# Altium schematic sheet node1.SchDoc
size A
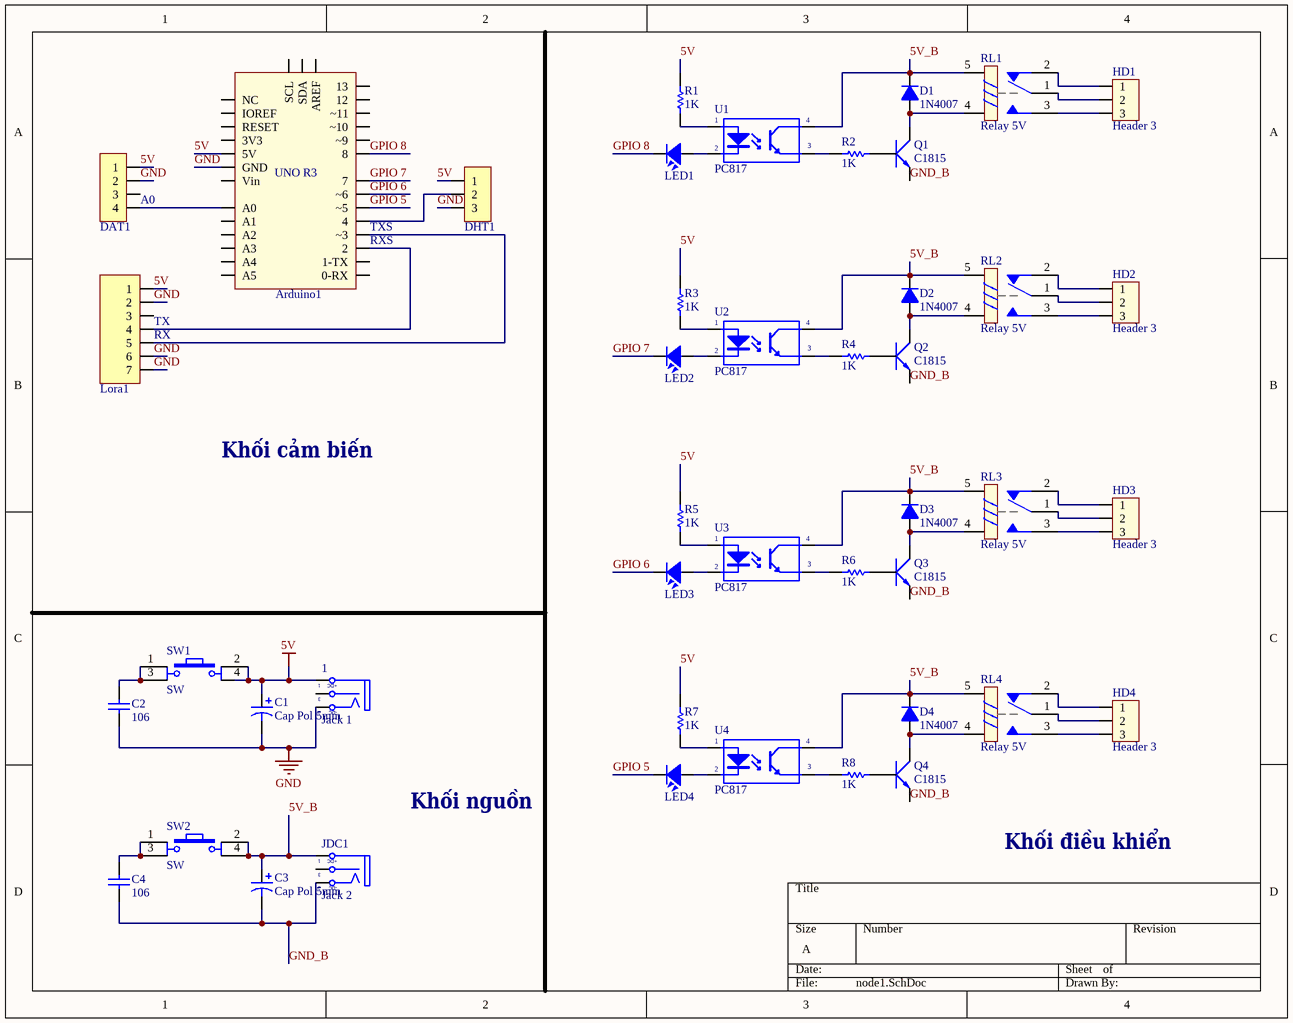
[diagram p0: node1.SchDoc]

## Parts
1  Jack 1  [DC-IN]
Arduino1  Arduino Uno R3  [Arduino UNO R3]  (value not drawn)
C1  Cap Pol 5mm  [C5mm]
C2  106  [Tu 0805]
C3  Cap Pol 5mm  [C5mm]
C4  106  [Tu 0805]
D1  1N4007  [D1A]
D2  1N4007  [D1A]
D3  1N4007  [D1A]
D4  1N4007  [D1A]
DAT1  (no value)  [JP4-C1T]
DHT1  (no value)  [JP3-C1T]
HD1  Header 3  [HED3]
HD2  Header 3  [HED3]
HD3  Header 3  [HED3]
HD4  Header 3  [HED3]
JDC1  Jack 2  [DC-IN]
LED1  LED  [LED-3]  (value not drawn)
LED2  LED  [LED-3]  (value not drawn)
LED3  LED  [LED-3]  (value not drawn)
LED4  LED  [LED-3]  (value not drawn)
Lora1  (no value)  [JP7-C1T]
Q1  C1815  [QTO-92]
Q2  C1815  [QTO-92]
Q3  C1815  [QTO-92]
Q4  C1815  [QTO-92]
R1  value 1K  [R1/4W]  (hidden comment: Res1)
R2  value 1K  [R1/4W]  (hidden comment: Res1)
R3  value 1K  [R1/4W]  (hidden comment: Res1)
R4  value 1K  [R1/4W]  (hidden comment: Res1)
R5  value 1K  [R1/4W]  (hidden comment: Res1)
R6  value 1K  [R1/4W]  (hidden comment: Res1)
R7  value 1K  [R1/4W]  (hidden comment: Res1)
R8  value 1K  [R1/4W]  (hidden comment: Res1)
RL1  Relay 5V  [RL_SPDT_10A]
RL2  Relay 5V  [RL_SPDT_10A]
RL3  Relay 5V  [RL_SPDT_10A]
RL4  Relay 5V  [RL_SPDT_10A]
SW1  SW  [SW4]
SW2  SW  [SW4]
U1  PC817  [DIP4/W0.3]
U2  PC817  [DIP4/W0.3]
U3  PC817  [DIP4/W0.3]
U4  PC817  [DIP4/W0.3]

## Nets
5V: 1.1(T) Arduino1.5V C1.1 DAT1.1 DHT1.1 Lora1.1 R1.2 R3.2 R5.2 R7.2 SW1.2 SW1.4
GND: 1.2(TN) Arduino1.GND C1.2 C2.2 DAT1.2 DHT1.3 Lora1.2 Lora1.6 Lora1.7
5V_B: C3.1 D1.2(K) D2.2(K) D3.2(K) D4.2(K) JDC1.1(T) RL1.5 RL2.5 RL3.5 RL4.5 SW2.2 SW2.4 U1.4(C) U2.4(C) U3.4(C) U4.4(C)
GND_B: C3.2 C4.2 JDC1.2(TN) Q1.1(E) Q2.1(E) Q3.1(E) Q4.1(E)
GPIO 5: Arduino1.~5 LED4.2
GPIO 6: Arduino1.~6 LED3.2
GPIO 7: Arduino1.7 LED2.2
GPIO 8: Arduino1.8 LED1.2
NetArduino1_2: Arduino1.2 Lora1.4
NetArduino1_4: Arduino1.4 DHT1.2
NetArduino1_A0: Arduino1.A0 DAT1.4
NetArduino1_~3: Arduino1.~3 Lora1.5
NetC2_1: C2.1 SW1.1 SW1.3
NetC4_1: C4.1 SW2.1 SW2.3
NetD1_1: D1.1(A) Q1.2(C) RL1.4
NetD2_1: D2.1(A) Q2.2(C) RL2.4
NetD3_1: D3.1(A) Q3.2(C) RL3.4
NetD4_1: D4.1(A) Q4.2(C) RL4.4
NetHD1_1: HD1.1 RL1.2
NetHD1_2: HD1.2 RL1.1
NetHD1_3: HD1.3 RL1.3
NetHD2_1: HD2.1 RL2.2
NetHD2_2: HD2.2 RL2.1
NetHD2_3: HD2.3 RL2.3
NetHD3_1: HD3.1 RL3.2
NetHD3_2: HD3.2 RL3.1
NetHD3_3: HD3.3 RL3.3
NetHD4_1: HD4.1 RL4.2
NetHD4_2: HD4.2 RL4.1
NetHD4_3: HD4.3 RL4.3
NetLED1_1: LED1.1 U1.2(K)
NetLED2_1: LED2.1 U2.2(K)
NetLED3_1: LED3.1 U3.2(K)
NetLED4_1: LED4.1 U4.2(K)
NetQ1_3: Q1.3(B) R2.1
NetQ2_3: Q2.3(B) R4.1
NetQ3_3: Q3.3(B) R6.1
NetQ4_3: Q4.3(B) R8.1
NetR1_1: R1.1 U1.1(A)
NetR2_2: R2.2 U1.3(E)
NetR3_1: R3.1 U2.1(A)
NetR4_2: R4.2 U2.3(E)
NetR5_1: R5.1 U3.1(A)
NetR6_2: R6.2 U3.3(E)
NetR7_1: R7.1 U4.1(A)
NetR8_2: R8.2 U4.3(E)

Not connected (* = marked no-connect by the designer): 1 3(S); Arduino1 0-RX 1-TX 3V3 12 13 A1 A2 A3 A4 A5 AREF IOREF NC RESET SCL SDA Vin ~9 ~10 ~11; DAT1 3; JDC1 3(S); Lora1 3

## Notes on the sheet
- (near DAT1) A0
- (near Arduino1) TXS
- (near Arduino1) RXS
- (near Lora1) TX
- (near Lora1) RX
- Khối cảm biến
- Khối nguồn
- Khối điều khiển
- (in symbol Arduino Uno R3) UNO R3
- (in symbol Jac_DC) +DC; -DC

## Library data of the parts
1 JDC1 = Jac_DC: Cắm; Ten_Linh_Kien: Jack DC5.5x2.1MM DC5501; Ma_Hang: MH000923; Don_Vi: Con; Kieu_Chan: *; Ghi_Chu: *; Chung_Loai: Cắm
Arduino1 = Arduino Uno R3: Value: Cau 1A
C1 C3 = Cap Pol 5mm: Polarized Capacitor (Axial); Published: 8-Jun-2000; LatestRevisionDate: 17-Jul-2002; LatestRevisionNote: Re-released for DXP Platform.; PackageReference: POLAR0.8; Publisher: Altium Limited
C2 C4 = Tu 0805 106 16V 10%: Dán; Ten_Linh_Kien: Tụ 0805 106-10uF 10% 16V; So_Chan: 2; Don_Vi: Con; Ma_Hang: MH004553; Chung_Loai: Dán; Kieu_Chan: *
D1-D4 = D1A: Diode 1A; Value: 1N4007
DAT1 = JP4: WR-PHD 2.54 mm Angled Socket Header; Manufacturer: W¨¹rth Elektronik eiSos GmbH; partNo: 613004143121; ComponentLink1 Description: Manufacturer; ComponentLink2 Description: Datasheet; NoPins: 04; Created Date: 29 March 2013; ComponentLink1URL: http://www.we-online.com; ComponentLink2URL: http://katalog.we-online.de/em/datasheet/6130xx143121.pdf; Created by: Karrer Zheng
DHT1 = JP3: WR-PHD 2.54 mm Angled Socket Header; Manufacturer: W¨¹rth Elektronik eiSos GmbH; partNo: 613003143121; ComponentLink1 Description: Manufacturer; ComponentLink2 Description: Datasheet; NoPins: 03; Created Date: 29 March 2013; ComponentLink1URL: http://www.we-online.com; ComponentLink2URL: http://katalog.we-online.de/em/datasheet/6130xx143121.pdf; Created by: Karrer Zheng
HD1-HD4 = Hed3: Header 3 (Green); Value: Header 3
LED1-LED4 = LED: LED Single colour Green and Red; Value: LED 3 ly Single Colour
Lora1 = JP7: WR-PHD 2.54 mm Angled Socket Header; Manufacturer: W¨¹rth Elektronik eiSos GmbH; partNo: 613007143121; ComponentLink1 Description: Manufacturer; ComponentLink2 Description: Datasheet; NoPins: 07; Created Date: 29 March 2013; ComponentLink1URL: http://www.we-online.com; ComponentLink2URL: http://katalog.we-online.de/em/datasheet/6130xx143121.pdf; Created by: Karrer Zheng
Q1-Q4 = C1815: NPN 600mW, ECB; Value: C1815
R1-R8 = Res1_1: Resistor; Manufacturer: Generic Components; Class: Passive; Published: 08/06/2000; Publisher: Altium Hobart Technology Centre; SubClass: Resistor
RL1-RL4 = Relay 1: Relay SPDT,10A - 12VDC 5 Pin; Value: Relay SPDT, 10A, 12V
SW1 SW2 = SW4: Switch button 4 pin; Value: Button chip 4 pin
U1-U4 = PC817: Single Opto; Value: PC817